# Altium schematic sheet ESP32_Schematic 3.SchDoc: ESP32_Schematic
size A4; Date: 4/13/2026; DrawnBy: JACOLOT Marine & GUILLEMOT Killian; Revision: Rev A; SheetNumber: 4; SheetTotal: 4
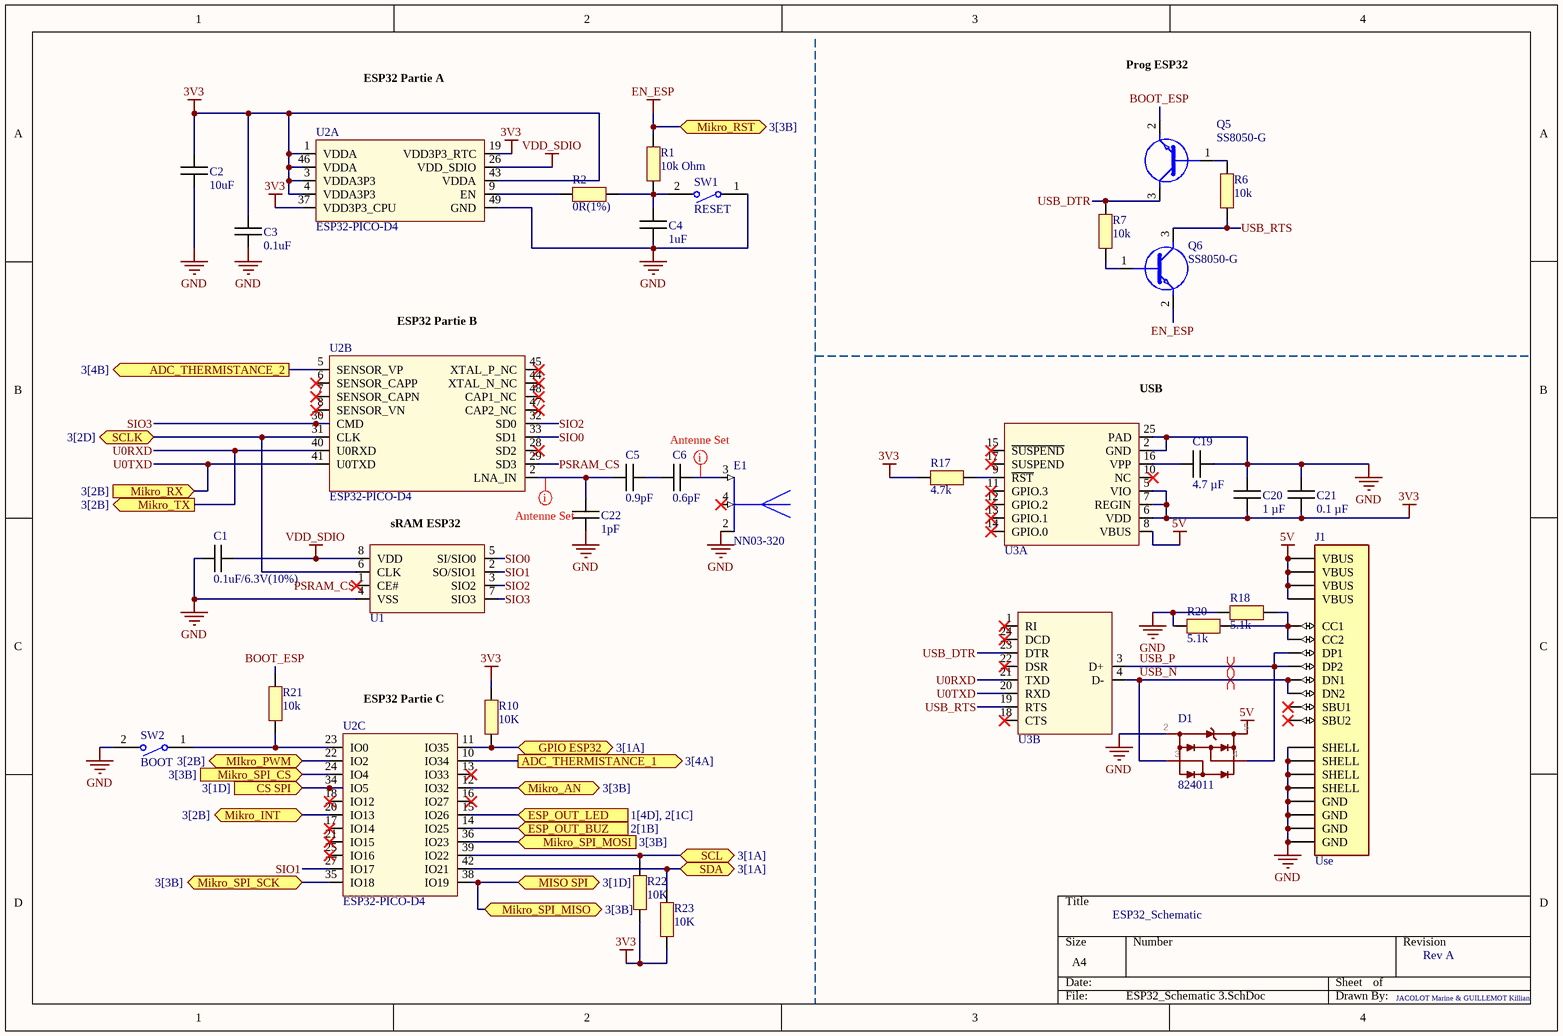
[diagram p0: ESP32_Schematic 3.SchDoc]

## Parts
C1  0.1uF/6.3V(10%)  [CAPC1005X06N]
C2  10uF  [CAPC1005X06N]
C3  0.1uF  [CAPC1005X06N]
C4  1uF  [CAPC1005X06N]
C5  0.9pF  [CAPC1005X06N]
C6  0.6pF  [CAPC1005X06N]
C19  4.7 µF  [CAPC1005X06N]
C20  1 µF  [CAPC1005X06N]
C21  0.1 µF  [CAPC1005X06N]
C22  1pF  [CAPC1005X06N]
D1  824011  [824011]
E1  NN03-320  [XCVR_NN03-320]
J1  Use  [USB4085-GF-A]
Q5  SS8050-G  [SS8050-G]
Q6  SS8050-G  [SS8050-G]
R1  10k Ohm  [RESC1005X06N]
R2  0R(1%)  [RESC1005X06N]
R6  10k  [RESC1005X06N]
R7  10k  [RESC1005X06N]
R10  10K  [RESC1005X06N]
R17  4.7k  [RESC1005X06N]
R18  5.1k  [RESC1005X06N]
R20  5.1k  [RESC1005X06N]
R21  10k  [RESC1005X06N]
R22  10K  [RESC1005X06N]
R23  10K  [RESC1005X06N]
SW1  RESET  [TECO-FSMSM-2_V]
SW2  BOOT  [TECO-FSMSM-2_V]
U1  IS66WVS1M8BLL-104NLI  [SOIC127P600X175-8N]  (value not drawn)
U2  ESP32-PICO-D4  [PQFN50P700X700X104_HS-49N]  (parts A,B,C of 3)
U3  CP2104-F03-GM  [PQFN50P400X400X80_HS-25N]  (value not drawn)  (parts A,B of 2)

## Ports
ADC_THERMISTANCE_1 (out, see 3[4A]), ADC_THERMISTANCE_2 (out, see 3[4B]), CS SPI (in, see 3[1D]), ESP_OUT_BUZ (in, see 2[1B]), ESP_OUT_LED (in, see 1[4D], 2[1C]), GPIO ESP32 (bidir, see 3[1A]), Mikro_AN (bidir, see 3[3B]), Mikro_INT (bidir, see 3[2B]), MIkro_PWM (bidir, see 3[2B]), Mikro_RST (bidir, see 3[3B]), Mikro_RX (in, see 3[2B]), Mikro_SPI_CS (in, see 3[3B]), Mikro_SPI_MISO (bidir, see 3[3B]), Mikro_SPI_MOSI (in, see 3[3B]), Mikro_SPI_SCK (bidir, see 3[3B]), Mikro_TX (out, see 3[2B]), MISO SPI (bidir, see 3[1D]), SCL (bidir, see 3[1A]), SCLK (bidir, see 3[2D]), SDA (bidir, see 3[1A])

## Nets
3V3: C2.1 C3.1 C20.2 C21.1 R10.2 R17.1 R22.1 R23.1 U2.1(VDDA) U2.3(VDDA3P3) U2.4(VDDA3P3) U2.19(VDD3P3_RTC) U2.37(VDD3P3_CPU) U2.43(VDDA) U2.46(VDDA) U3.5(VIO) U3.6(VDD) U3.7(REGIN)
5V: D1.5(VDD) J1.A4(VBUS) J1.A9(VBUS) J1.B4(VBUS) J1.B9(VBUS) U3.8(VBUS)
EN_ESP: Q6.2(E) R1.1 ; port Mikro_RST
GND: C1.1 C2.2 C3.2 C4.2 C19.2 C20.1 C21.2 C22.2 D1.2(GND) E1.2(GROUND) J1.A1(GND) J1.A12(GND) J1.B1(GND) J1.B12(GND) J1.S1(SHELL) J1.S2(SHELL) J1.S3(SHELL) J1.S4(SHELL) R18.1 R20.1 SW1.1 SW2.2 U1.4(VSS) U2.49(GND) U3.2(GND) U3.25(PAD)
VDD_SDIO: C1.2 U1.8(VDD) U2.26(VDD_SDIO)
ADC_THERMISTANCE_1: U2.10(IO34) ; port ADC_THERMISTANCE_1
ADC_THERMISTANCE_2: U2.5(SENSOR_VP) ; port ADC_THERMISTANCE_2
BOOT_ESP: Q5.2(E) R21.2
CS SPI: U2.34(IO5) ; port CS SPI
ESP_OUT_BUZ: U2.14(IO25) ; port ESP_OUT_BUZ
ESP_OUT_LED: U2.15(IO26) ; port ESP_OUT_LED
GPIO ESP32: R10.1 U2.11(IO35) ; port GPIO ESP32
Mikro_AN: U2.12(IO32) ; port Mikro_AN
Mikro_INT: U2.20(IO13) ; port Mikro_INT
MIkro_PWM: U2.22(IO2) ; port MIkro_PWM
Mikro_SPI_CS: U2.24(IO4) ; port Mikro_SPI_CS
Mikro_SPI_MISO: U2.38(IO19) ; port MISO SPI, port Mikro_SPI_MISO
Mikro_SPI_MOSI: U2.36(IO23) ; port Mikro_SPI_MOSI
Mikro_SPI_SCK: U2.35(IO18) ; port Mikro_SPI_SCK
PSRAM_CS: U1.1(CE#) U2.29(SD3)
SCL: R22.2 U2.39(IO22) ; port SCL
SCLK: U1.6(CLK) U2.31(CLK) ; port SCLK
SDA: R23.2 U2.42(IO21) ; port SDA
SIO0: U1.5(SI/SIO0) U2.33(SD1)
SIO1: U1.2(SO/SIO1) U2.27(IO17)
SIO2: U1.3(SIO2) U2.32(SD0)
SIO3: U1.7(SIO3) U2.30(CMD)
U0RXD: U2.40(U0RXD) U3.21(TXD) ; port Mikro_TX
U0TXD: U2.41(U0TXD) U3.20(RXD) ; port Mikro_RX
USB_DTR: Q5.3(C) R7.1 U3.23(DTR)
USB_N: D1.3 J1.A7(DN1) J1.B7(DN2) U3.4(D-)
USB_P: D1.4 J1.A6(DP1) J1.B6(DP2) U3.3(D+)
USB_RTS: Q6.3(C) R6.1 U3.19(RTS)
NetC4_1: C4.1 R1.2 R2.2 SW1.2
NetC5_1: C5.1 C22.1 U2.2(LNA_IN)
NetC5_2: C5.2 C6.1
NetC6_2: C6.2 E1.3(FEED_BLUETOOTH)
NetC19_1: C19.1 U3.16(VPP)
NetJ1_A5: J1.A5(CC1) J1.B5(CC2) R18.2 R20.2
NetQ5_1: Q5.1(B) R6.2
NetQ6_1: Q6.1(B) R7.2
NetR2_1: R2.1 U2.9(EN)
NetR17_2: R17.2 U3.9(~{RST})
NetR21_1: R21.1 SW2.1 U2.23(IO0)

Not connected (* = marked no-connect by the designer): E1 4(FEED_GNSS)*; J1 A8(SBU1)* B8(SBU2)*; U2 6(SENSOR_CAPP)* 7(SENSOR_CAPN)* 8(SENSOR_VN)* 13(IO33)* 16(IO27)* 17(IO14)* 18(IO12)* 21(IO15)* 25(IO16)* 28(SD2)* 44(XTAL_N_NC)* 45(XTAL_P_NC)* 47(CAP2_NC)* 48(CAP1_NC)*; U3 1(RI)* 10(NC)* 11(GPIO.3)* 12(GPIO.2)* 13(GPIO.1)* 14(GPIO.0)* 15(~{SUSPEND})* 17(SUSPEND)* 18(CTS)* 22(DSR)* 24(DCD)*

## Layout directives
differential pair; differential pair class USB; rule Differential Pairs Routing [Pref Gap = 0.127mm    Min Gap  = 0.127mm    Max Gap  = 0.127mmPref Width = 0.252mm    Min Width  = 0.11mm    Max Width  = 0.252mm]: USB_N, USB_P
rule Width Constraint [Pref Impedance = 50.00ohms    Min Impedance = 50.00ohms    Max Impedance = 50.00ohms]: NetC5_1, NetC6_2

## Notes on the sheet
- ESP32 Partie A
- Prog ESP32
- (near U2) ESP32 Partie B
- (near U3) USB
- sRAM ESP32
- ESP32 Partie C

## Library data of the parts
C1-C6 C19-C22 = Capacitor
D1 = 824011: TVS Diode Array WE-TVS, High Speed Series  - Low capazity - No leakage current - Low clamping voltage - high ESD voltage protection  -- USB 1.0 - 2.0
E1 = NN03-320: Dual port antenna booster for GNSS, Bluetooth, 5G and UWB (1561 - 1606MHz, 2400 - 2500MHz, 3400 - 3800MHz, 3100 - 4800MHz and 6000 - 10600 MHz), signal booster; Manufacturer_Name: Ignion; Manufacturer_Part_Number: NN03-320; Mouser Part Number: 128-NN03-320
J1 = USB4085-GF-A: Connecteurs USB USB Type C, 2.0, Rec, TH , G/F, RA , Top Mnt, T & R
Q5 Q6 = SS8050-G: Bipolar Transistors - BJT NPN TRANSISTOR 1.5A 40V
R1 R2 R6 R7 R10 R17 R18 R20-R23 = Resistor
SW1 SW2 = CMP-2000-07511-1: FSMSM Push Button Switch, 50 mA, -35 to 85 degC, 2-Pin SMD, RoHS, Bulk; Manufacturer: TE Connectivity; Actuator Length: 1.07mm; Electrical Life: 20000Cycles; Actuator Material: Polyamide; Current Rating: 50mA; Illumination Type: Illuminated; Voltage Rating (DC): 24V; Contact Resistance: 100mOhm; Case\/Package: SMD/SMT; Operating Force: 180gf; Switch Travel: 0.25mm; Max Voltage Rating (DC): 12V; Throw Configuration: SPST; Packaging: LoosePiece; Max Operating Temperature: 85degC; ELV: Compliant; Package Description: 2-Pin Surface Mount Device, Body 6 x 3.5 mm, Pitch 9.19 mm; RoHSCompliant: true; Manufacturer URL: http://www.te.com/; Contact Plating: Silver; Contact Material: Brass; Mounting Technology: SurfaceMount; Contact Current Rating: 50mA; Datasheet Version: Rev. C2, 08/2014; Datasheet URL: http://www.te.com/commerce/DocumentDelivery/DDEController?Action=showdoc&DocId=Customer+Drawing%7F1437566-3%7FC2%7Fpdf%7FEnglish%7FENG_CD_1437566-3_C2_1437566_3_1_c.dwg.pdf%7F1437566-3; Mechanical Life: 20000Cycles; Package Reference: FSMSM; REACH SVHC: Unknown; Orientation: Straight; Min Operating Temperature: -35degC; Lead Free: LeadFree; Termination: GullWing; Package Quantity: 1000; Mount: SurfaceMount
U1 = SRAM: SRAM 8Mb, SerialRAM, 2.7V-3.6V, 104MHz, 8 pin SOIC 150 mil, RoHS; Manufacturer 1: ISSI; Supplier 1: Digi-Key; Supplier Part Number 1: 706-IS66WVS1M8BLL-104NLI-ND; Manufactuer Part Number 1: IS66WVS1M8BLL-104NLI
U2 = ESP32: Système RF sur puce - SoC SIP module ESP32 with 4MByte Flash, Dual Core MCU, Wi-Fi & Bluetooth Combo, LGA48-pin, 7*7mm; Manufacturer 1: Espressif Systems; Supplier 1: Digi-Key; Supplier Part Number 1: 1904-1029-1-ND; Manufacturer Part Number 1: ESP32-PICO-D4
U3 = USBBridge: USB Bridge, USB to UART USB 2.0 UART Interface 24-QFN (4x4); Manufacturer 1: Silicon Labs; Supplier 1: Arrow Electronics; Supplier Part Number 1: CP2104-F03-GM; Manufacturer Part Number 1: CP2104-F03-GM